# Altium project FastTrig_Board.PrjPCB
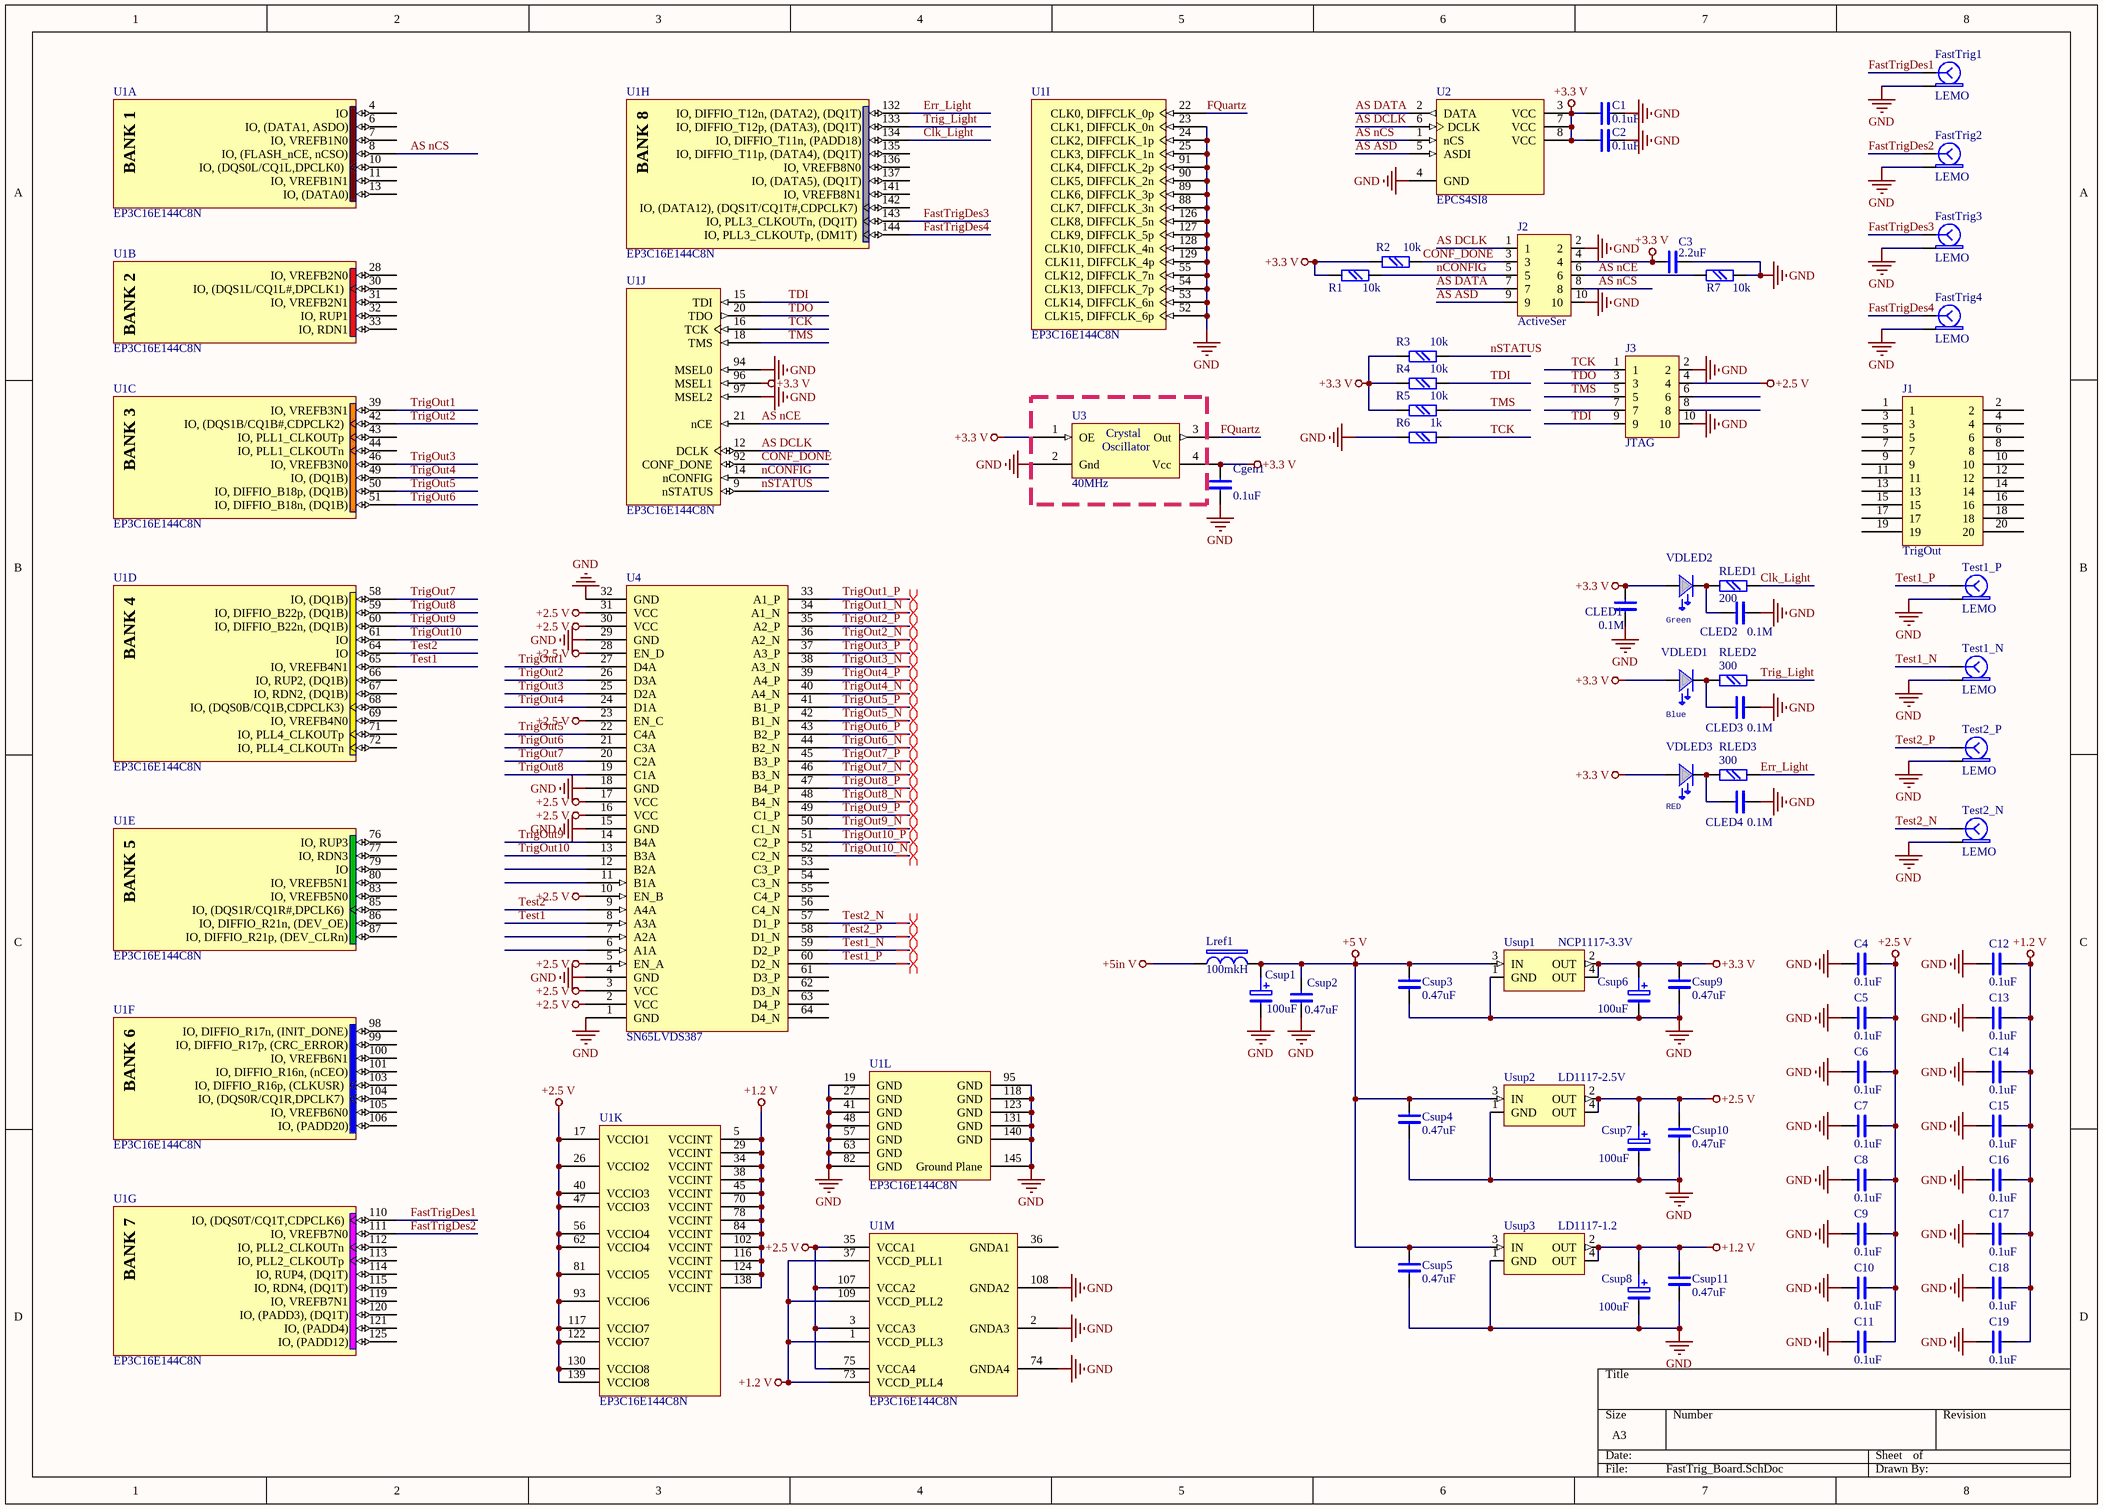
[diagram p0: FastTrig_Board.SchDoc]
1 sheet, 67 parts. Net scope: global (net labels, ports and power ports of the same name join across sheets).
Board file: FastTrig_board.PcbDoc

## Sheet FastTrig_Board.SchDoc
size A3

### Parts
C1  0.1uF  [chip0603]
C2  0.1uF  [chip0603]
C3  2.2uF  [chip0603]
C4  0.1uF  [chip0402]
C5  0.1uF  [chip0402]
C6  0.1uF  [chip0402]
C7  0.1uF  [chip0402]
C8  0.1uF  [chip0402]
C9  0.1uF  [chip0402]
C10  0.1uF  [chip0402]
C11  0.1uF  [chip0402]
C12  0.1uF  [chip0402]
C13  0.1uF  [chip0402]
C14  0.1uF  [chip0402]
C15  0.1uF  [chip0402]
C16  0.1uF  [chip0402]
C17  0.1uF  [chip0402]
C18  0.1uF  [chip0402]
C19  0.1uF  [chip0402]
Cgen1  0.1uF  [chip0603]
CLED1  0.1M  [chip0805]
CLED2  0.1M  [chip0805]
CLED3  0.1M  [chip0805]
CLED4  0.1M  [chip0805]
Csup1  100uF  [CEL-SMD300]
Csup2  0.47uF  [chip0603]
Csup3  0.47uF  [chip0603]
Csup4  0.47uF  [chip0603]
Csup5  0.47uF  [chip0603]
Csup6  100uF  [CEL-SMD300]
Csup7  100uF  [CEL-SMD300]
Csup8  100uF  [CEL-SMD300]
Csup9  0.47uF  [chip0603]
Csup10  0.47uF  [chip0603]
Csup11  0.47uF  [chip0603]
FastTrig1  LEMO  [LEMO]
FastTrig2  LEMO  [LEMO]
FastTrig3  LEMO  [LEMO]
FastTrig4  LEMO  [LEMO]
J1  TrigOut  [IDC-20_2x10_1.27]
J2  ActiveSer  [IDC10]
J3  JTAG  [IDC10]
Lref1  100mkH  [SDR0604]
R1  10k  [chip0603]
R2  10k  [chip0603]
R3  10k  [chip0603]
R4  10k  [chip0603]
R5  10k  [chip0603]
R6  1k  [chip0603]
R7  10k  [chip0603]
RLED1  200  [chip0805]
RLED2  300  [chip0805]
RLED3  300  [chip0805]
Test1_N  LEMO  [LEMO]
Test1_P  LEMO  [LEMO]
Test2_N  LEMO  [LEMO]
Test2_P  LEMO  [LEMO]
U1  EP3C16E144C8N  [EQFP144_N]  (parts A,B,C,D,E,F,G,H,I,J,K,L,M of 13)
U2  EPCS4SI8  [8SO200]
U3  40MHz  [SG-636]
U4  SN65LVDS387  [DGG064]
Usup1  NCP1117-3.3V  [TO-252]
Usup2  LD1117-2.5V  [TO-252]
Usup3  LD1117-1.2  [TO-252]
VDLED1  LED  [CHIP1206]  (value not drawn)
VDLED2  LED  [CHIP0805]  (value not drawn)
VDLED3  LED  [CHIP1206]  (value not drawn)

### Nets
+1.2 V: C12.2 C13.2 C14.2 C15.2 C16.2 C17.2 C18.2 C19.2 Csup8.+ Csup11.1 U1.1(VCCD_PLL3) U1.5(VCCINT) U1.29(VCCINT) U1.34(VCCINT) U1.37(VCCD_PLL1) U1.38(VCCINT) U1.45(VCCINT) U1.70(VCCINT) U1.73(VCCD_PLL4) U1.78(VCCINT) U1.84(VCCINT) U1.102(VCCINT) U1.109(VCCD_PLL2) U1.116(VCCINT) U1.124(VCCINT) U1.138(VCCINT) Usup3.2(OUT) Usup3.4(OUT)
+2.5 V: C4.2 C5.2 C6.2 C7.2 C8.2 C9.2 C10.2 C11.2 Csup7.+ Csup10.1 J3.4 U1.3(VCCA3) U1.17(VCCIO1) U1.26(VCCIO2) U1.35(VCCA1) U1.40(VCCIO3) U1.47(VCCIO3) U1.56(VCCIO4) U1.62(VCCIO4) U1.75(VCCA4) U1.81(VCCIO5) U1.93(VCCIO6) U1.107(VCCA2) U1.117(VCCIO7) U1.122(VCCIO7) U1.130(VCCIO8) U1.139(VCCIO8) U4.2(VCC) U4.3(VCC) U4.5(EN_A) U4.10(EN_B) U4.16(VCC) U4.17(VCC) U4.23(EN_C) U4.28(EN_D) U4.30(VCC) U4.31(VCC) Usup2.2(OUT) Usup2.4(OUT)
+3.3 V: C1.2 C2.2 C3.1 Cgen1.2 CLED1.1 Csup6.+ Csup9.1 J2.4 R1.1 R2.1 R3.1 R4.1 R5.1 U1.96(MSEL1) U2.3(VCC) U2.7(VCC) U2.8(VCC) U3.1(OE) U3.4(Vcc) Usup1.2(OUT) Usup1.4(OUT) VDLED1.ANOD VDLED2.ANOD VDLED3.ANOD
+5 V: Csup1.+ Csup2.1 Csup3.1 Csup4.1 Csup5.1 Lref1.2 Usup1.3(IN) Usup2.3(IN) Usup3.3(IN)
+5in V: Lref1.1
GND: C1.1 C2.1 C3.2 C4.1 C5.1 C6.1 C7.1 C8.1 C9.1 C10.1 C11.1 C12.1 C13.1 C14.1 C15.1 C16.1 C17.1 C18.1 C19.1 Cgen1.1 CLED1.2 CLED2.2 CLED3.2 CLED4.2 Csup1.- Csup2.2 Csup3.2 Csup4.2 Csup5.2 Csup6.- Csup7.- Csup8.- Csup9.2 Csup10.2 Csup11.2 FastTrig1.SHIELD FastTrig2.SHIELD FastTrig3.SHIELD FastTrig4.SHIELD J2.2 J2.10 J3.2 J3.10 R6.1 R7.2 Test1_N.SHIELD Test1_P.SHIELD Test2_N.SHIELD Test2_P.SHIELD U1.2(GNDA3) U1.19(GND) U1.23(CLK1,_DIFFCLK_0n) U1.24(CLK2,_DIFFCLK_1p) U1.25(CLK3,_DIFFCLK_1n) U1.27(GND) U1.41(GND) U1.48(GND) U1.52(CLK15,_DIFFCLK_6p) U1.53(CLK14,_DIFFCLK_6n) U1.54(CLK13,_DIFFCLK_7p) U1.55(CLK12,_DIFFCLK_7n) U1.57(GND) U1.63(GND) U1.74(GNDA4) U1.82(GND) U1.88(CLK7,_DIFFCLK_3n) U1.89(CLK6,_DIFFCLK_3p) U1.90(CLK5,_DIFFCLK_2n) U1.91(CLK4,_DIFFCLK_2p) U1.94(MSEL0) U1.95(GND) U1.97(MSEL2) U1.108(GNDA2) U1.118(GND) U1.123(GND) U1.126(CLK8,_DIFFCLK_5n) U1.127(CLK9,_DIFFCLK_5p) U1.128(CLK10,_DIFFCLK_4n) U1.129(CLK11,_DIFFCLK_4p) U1.131(GND) U1.140(GND) U1.145(Ground_Plane) U2.4(GND) U3.2(Gnd) U4.1(GND) U4.4(GND) U4.15(GND) U4.18(GND) U4.29(GND) U4.32(GND) Usup1.1(GND) Usup2.1(GND) Usup3.1(GND)
AS ASD: J2.9 U2.5(ASDI)
AS DATA: J2.7 U2.2(DATA)
AS DCLK: J2.1 U1.12(DCLK) U2.6(DCLK)
AS nCE: J2.6 R7.1 U1.21(nCE)
AS nCS: J2.8 U1.8(IO,_(FLASH_nCE,_nCSO)) U2.1(nCS)
Clk_Light: RLED1.2 U1.134(IO,_DIFFIO_T11n,_(PADD18))
CONF_DONE: J2.3 R2.2 U1.92(CONF_DONE)
Err_Light: RLED3.2 U1.132(IO,_DIFFIO_T12n,_(DATA2),_(DQ1T))
FastTrigDes1: FastTrig1.WIRE U1.110(IO,_(DQS0T/CQ1T,CDPCLK6))
FastTrigDes2: FastTrig2.WIRE U1.111(IO,_VREFB7N0)
FastTrigDes3: FastTrig3.WIRE U1.143(IO,_PLL3_CLKOUTn,_(DQ1T))
FastTrigDes4: FastTrig4.WIRE U1.144(IO,_PLL3_CLKOUTp,_(DM1T))
FQuartz: U1.22(CLK0,_DIFFCLK_0p) U3.3(Out)
nCONFIG: J2.5 R1.2 U1.14(nCONFIG)
nSTATUS: R3.2 U1.9(nSTATUS)
TCK: J3.1 R6.2 U1.16(TCK)
TDI: J3.9 R4.2 U1.15(TDI)
TDO: J3.3 U1.20(TDO)
Test1: U1.65(IO,_VREFB4N1) U4.8(A3A)
Test1_N: Test1_N.WIRE U4.59(D2_P)
Test1_P: Test1_P.WIRE U4.60(D2_N)
Test2: U1.64(IO) U4.9(A4A)
Test2_N: Test2_N.WIRE U4.57(D1_P)
Test2_P: Test2_P.WIRE U4.58(D1_N)
TMS: J3.5 R5.2 U1.18(TMS)
Trig_Light: RLED2.2 U1.133(IO,_DIFFIO_T12p,_(DATA3),_(DQ1T))
TrigOut1: U1.39(IO,_VREFB3N1) U4.27(D4A)
TrigOut1_N: U4.34(A1_N)
TrigOut1_P: U4.33(A1_P)
TrigOut2: U1.42(IO,_(DQS1B/CQ1B#,CDPCLK2)) U4.26(D3A)
TrigOut2_N: U4.36(A2_N)
TrigOut2_P: U4.35(A2_P)
TrigOut3: U1.46(IO,_VREFB3N0) U4.25(D2A)
TrigOut3_N: U4.38(A3_N)
TrigOut3_P: U4.37(A3_P)
TrigOut4: U1.49(IO,_(DQ1B)) U4.24(D1A)
TrigOut4_N: U4.40(A4_N)
TrigOut4_P: U4.39(A4_P)
TrigOut5: U1.50(IO,_DIFFIO_B18p,_(DQ1B)) U4.22(C4A)
TrigOut5_N: U4.42(B1_N)
TrigOut5_P: U4.41(B1_P)
TrigOut6: U1.51(IO,_DIFFIO_B18n,_(DQ1B)) U4.21(C3A)
TrigOut6_N: U4.44(B2_N)
TrigOut6_P: U4.43(B2_P)
TrigOut7: U1.58(IO,_(DQ1B)) U4.20(C2A)
TrigOut7_N: U4.46(B3_N)
TrigOut7_P: U4.45(B3_P)
TrigOut8: U1.59(IO,_DIFFIO_B22p,_(DQ1B)) U4.19(C1A)
TrigOut8_N: U4.48(B4_N)
TrigOut8_P: U4.47(B4_P)
TrigOut9: U1.60(IO,_DIFFIO_B22n,_(DQ1B)) U4.14(B4A)
TrigOut9_N: U4.50(C1_N)
TrigOut9_P: U4.49(C1_P)
TrigOut10: U1.61(IO) U4.13(B3A)
TrigOut10_N: U4.52(C2_N)
TrigOut10_P: U4.51(C2_P)
NetCLED2_1: CLED2.1 RLED1.1 VDLED2.CATH
NetCLED3_1: CLED3.1 RLED2.1 VDLED1.CATH
NetCLED4_1: CLED4.1 RLED3.1 VDLED3.CATH

Not connected (* = marked no-connect by the designer): J1 1 2 3 4 5 6 7 8 9 10 11 12 13 14 15 16 17 18 19 20; J3 6 7 8; U1 4(IO) 6(IO,_(DATA1,_ASDO)) 7(IO,_VREFB1N0) 10(IO,_(DQS0L/CQ1L,DPCLK0)) 11(IO,_VREFB1N1) 13(IO,_(DATA0)) 28(IO,_VREFB2N0) 30(IO,_(DQS1L/CQ1L#,DPCLK1)) 31(IO,_VREFB2N1) 32(IO,_RUP1) 33(IO,_RDN1) 36(GNDA1) 43(IO,_PLL1_CLKOUTp) 44(IO,_PLL1_CLKOUTn) 66(IO,_RUP2,_(DQ1B)) 67(IO,_RDN2,_(DQ1B)) 68(IO,_(DQS0B/CQ1B,CDPCLK3)) 69(IO,_VREFB4N0) 71(IO,_PLL4_CLKOUTp) 72(IO,_PLL4_CLKOUTn) 76(IO,_RUP3) 77(IO,_RDN3) 79(IO) 80(IO,_VREFB5N1) 83(IO,_VREFB5N0) 85(IO,_(DQS1R/CQ1R#,DPCLK6)) 86(IO,_DIFFIO_R21n,_(DEV_OE)) 87(IO,_DIFFIO_R21p,_(DEV_CLRn)) 98(IO,_DIFFIO_R17n,_(INIT_DONE)) 99(IO,_DIFFIO_R17p,_(CRC_ERROR)) 100(IO,_VREFB6N1) 101(IO,_DIFFIO_R16n,_(nCEO)) 103(IO,_DIFFIO_R16p,_(CLKUSR)) 104(IO,_(DQS0R/CQ1R,DPCLK7)) 105(IO,_VREFB6N0) 106(IO,_(PADD20)) 112(IO,_PLL2_CLKOUTn) 113(IO,_PLL2_CLKOUTp) 114(IO,_RUP4,_(DQ1T)) 115(IO,_RDN4,_(DQ1T)) 119(IO,_VREFB7N1) 120(IO,_(PADD3),_(DQ1T)) 121(IO,_(PADD4)) 125(IO,_(PADD12)) 135(IO,_DIFFIO_T11p,_(DATA4),_(DQ1T)) 136(IO,_VREFB8N0) 137(IO,_(DATA5),_(DQ1T)) 141(IO,_VREFB8N1) 142(IO,_(DATA12),_(DQS1T/CQ1T#,CDPCLK7)); U4 6(A1A) 7(A2A) 11(B1A) 12(B2A) 53(C3_P) 54(C3_N) 55(C4_P) 56(C4_N) 61(D3_P) 62(D3_N) 63(D4_P) 64(D4_N)

### Layout directives
differential pair: Test1_N, Test1_P, Test2_N, Test2_P, TrigOut1_N, TrigOut1_P, TrigOut2_N, TrigOut2_P, TrigOut3_N, TrigOut3_P, TrigOut4_N, TrigOut4_P, TrigOut5_N, TrigOut5_P, TrigOut6_N, TrigOut6_P, TrigOut7_N, TrigOut7_P, TrigOut8_N, TrigOut8_P, TrigOut9_N, TrigOut9_P, TrigOut10_N, TrigOut10_P

### Notes on the sheet
- Green
- Blue
- (near VDLED3) RED
- (in symbol EP3C16E144C8N, part A) BANK 1
- (in symbol EP3C16E144C8N, part B) BANK 2
- (in symbol EP3C16E144C8N, part C) BANK 3
- (in symbol EP3C16E144C8N, part D) BANK 4
- (in symbol EP3C16E144C8N, part E) BANK 5
- (in symbol EP3C16E144C8N, part F) BANK 6
- (in symbol EP3C16E144C8N, part G) BANK 7
- (in symbol EP3C16E144C8N, part H) BANK 8
- (in symbol SG-636) Crystal; Oscillator

### Library data of the parts
C1-C19 Cgen1 CLED1-CLED4 Csup2-Csup5 Csup9-Csup11 = C: Text Field1: 20; Text Field2: 10
Csup1 Csup6-Csup8 = C POL: Text Field1: 20; Text Field2: 20
FastTrig1-FastTrig4 Test1_N Test1_P Test2_N Test2_P = LEMO: Text Field1: 20; Text Field2: 20
J1 = IDC-20_2x10_1.27
J2 J3 = IDC-10: Text Field1: 40; Text Field2: 60
Lref1 = DR: Text Field1: 30; Text Field2: 10
R1-R7 RLED1-RLED3 = R: Text Field1: 20; Text Field2: 20
U1 = EP3C16E144C8N: Cyclone III Family FPGA, 84 I/O Pins, 4 PLLs, 144-Pin EQFP, Speed Grade 8, Commercial Grade, Pb-Free; Note: Exposed pad at the bottom of this package must be connected to PCB GND.; Published: 26-Feb-2007; LatestRevisionDate: 14-Dec-2007; LatestRevisionNote: Thermal Pad dimensions changed.; DatasheetVersion: ver2.0, May-2008; PackageVersion: ver16.0, Dec-2009; PackageReference: EQFP144; Publisher: Altium Limited; PackageDescription: 144-Pin Plastic Enhanced Quad Flat Pack (EQFP144) - Wire Bond; Supplier 1: Digi-Key; Supplier Part Number 1: 544-2456-ND; Supplier 2: Farnell; Supplier Part Number 2: 1635061; Code_JEDEC: MS-026-BFB; ComponentLink1Description: Manufacturer Link; ComponentLink1URL: http://www.altera.com/; ComponentLink2Description: Handbook (7.86MB); ComponentLink2URL: http://www.altera.com/literature/hb/cyc3/cyclone3_handbook.pdf; ComponentLink3Description: Packaging Specification; ComponentLink3URL: http://www.altera.com/literature/ds/dspkg.pdf
U2 = EPCS4SI8: EPCS4 Series, In-system programmable 3.3V serial configuration device, 8-Pin SOIC, 4-Megabit, Industrial Grade; Configures: Cyclone II, Stratix II, & Cyclone Devices; Published: 17-Sep-2003; LatestRevisionDate: 13-Apr-2006; LatestRevisionNote: IPC-7351 Footprint Added.; DatasheetVersion: ver2.0, Oct-2003; PackageVersion: ver14.2, Oct-2005; PackageReference: SOIC8; Publisher: Altium Limited; PackageDescription: 8-Pin Small Outline Integrated Circuit Package (SOIC8); Supplier 1: Digi-Key; Supplier Part Number 1: 544-1243-5-ND; Code_JEDEC: MS-012-AA; Code_IPC: SOIC127P600-8; ComponentLink1Description: Manufacturer Link; ComponentLink1URL: http://www.altera.com/products/devices/config/cfg-index.html; ComponentLink2Description: Configuration Handbook; ComponentLink2URL: http://www.altera.com/literature/hb/cfg/config_handbook.pdf; ComponentLink3Description: Pinout Specification; ComponentLink3URL: http://www.altera.com/literature/hb/cfg/cyc_c51014.pdf; ComponentLink4Description: Packaging Specification; ComponentLink4URL: http://www.altera.com/literature/ds/dspkg.pdf
U3 = SG-636: Crystal Oscillator (SMD)
Usup2 Usup3 = NCP1117-3.3V
VDLED1-VDLED3 = AL307: Text Field1: 10; Text Field2: 30